# EAGLE design ALU (EAGLE 6.3)
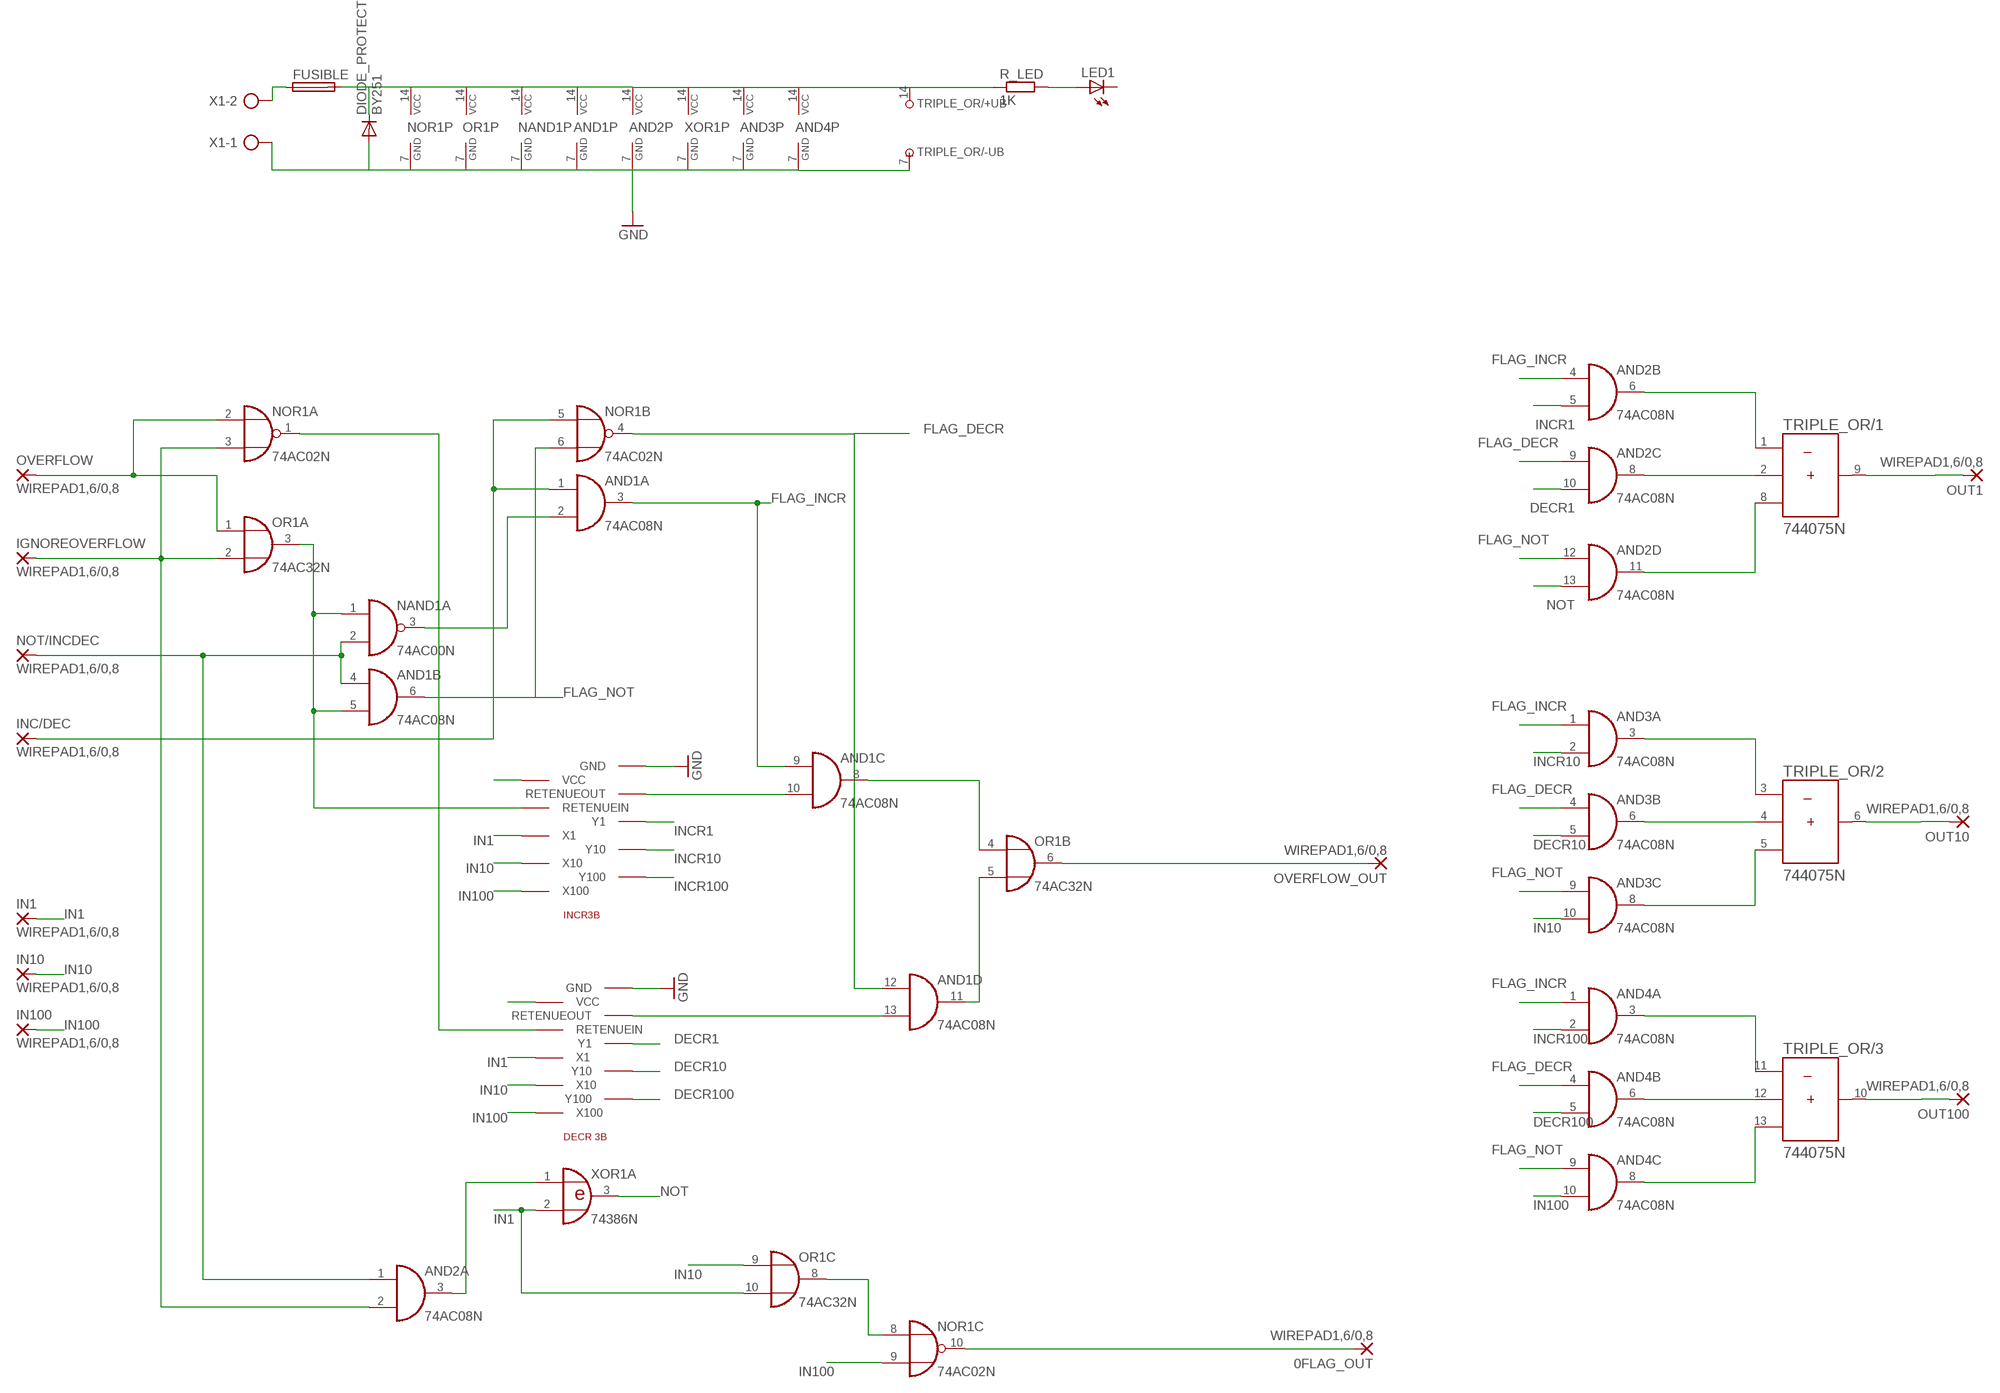
[diagram p0: schematic, sheet 1]

## Parts
0FLAG_OUT  WIREPAD1,6/0,8  [1,6/0,8]
AND1  74AC08N  [DIL14]
AND2  74AC08N  [DIL14]
AND3  74AC08N  [DIL14]
AND4  74AC08N  [DIL14]
DECR3B  DECR3B  [DECR3B]
DIODE_PROTECT  BY251  [DO201-15]
FUSIBLE  SH22,5A  [SH22,5A]
IGNOREOVERFLOW  WIREPAD1,6/0,8  [1,6/0,8]
IN1  WIREPAD1,6/0,8  [1,6/0,8]
IN10  WIREPAD1,6/0,8  [1,6/0,8]
IN100  WIREPAD1,6/0,8  [1,6/0,8]
INC/DEC  WIREPAD1,6/0,8  [1,6/0,8]
INCR3B  INCR3B  [INCR3B]
LED1  LEDSFH482  [SFH482]
NAND1  74AC00N  [DIL14]
NOR1  74AC02N  [DIL14]
NOT/INCDEC  WIREPAD1,6/0,8  [1,6/0,8]
OR1  74AC32N  [DIL14]
OUT1  WIREPAD1,6/0,8  [1,6/0,8]
OUT10  WIREPAD1,6/0,8  [1,6/0,8]
OUT100  WIREPAD1,6/0,8  [1,6/0,8]
OVERFLOW  WIREPAD1,6/0,8  [1,6/0,8]
OVERFLOW_OUT  WIREPAD1,6/0,8  [1,6/0,8]
R_LED  1K  R-EU_0207/10  [0207/10]
TRIPLE_OR  744075N  [DIL14]
X1  AK300/2  [AK300/2]
XOR1  74386N  [DIL14]

## Nets
0FLAG_OUT: 0FLAG_OUT.1(P) NOR1.10(C:O)
DECR1: AND2.10(C:I1) DECR3B.Y1
DECR10: AND3.5(B:I1) DECR3B.Y10
DECR100: AND4.5(B:I1) DECR3B.Y100
FLAG_DECR: AND1.12(D:I0) AND2.9(C:I0) AND3.4(B:I0) AND4.4(B:I0) NOR1.4(B:O)
FLAG_INCR: AND1.3(A:O) AND1.9(C:I0) AND2.4(B:I0) AND3.1(A:I0) AND4.1(A:I0)
FLAG_NOT: AND1.6(B:O) AND2.12(D:I0) AND3.9(C:I0) AND4.9(C:I0) NOR1.6(B:I1)
GND: AND1.7(P:GND) AND2.7(P:GND) AND3.7(P:GND) AND4.7(P:GND) DECR3B.GND DIODE_PROTECT.A INCR3B.GND NAND1.7(P:GND) NOR1.7(P:GND) OR1.7(P:GND) TRIPLE_OR.7(/-UB:-UB) X1.1 XOR1.7(P:GND)
IN1: DECR3B.X1 IN1.1(P) INCR3B.X1 OR1.10(C:I1) XOR1.2(A:I1)
IN10: AND3.10(C:I1) DECR3B.X10 IN10.1(P) INCR3B.X10 OR1.9(C:I0)
IN100: AND4.10(C:I1) DECR3B.X100 IN100.1(P) INCR3B.X100 NOR1.9(C:I1)
INCR1: AND2.5(B:I1) INCR3B.Y1
INCR10: AND3.2(A:I1) INCR3B.Y10
INCR100: AND4.2(A:I1) INCR3B.Y100
N$1: NOR1.2(A:I0) OR1.1(A:I0) OVERFLOW.1(P)
N$2: AND2.6(B:O) TRIPLE_OR.1(/1:A)
N$3: AND1.2(A:I1) NAND1.3(A:O)
N$4: AND1.1(A:I0) INC/DEC.1(P) NOR1.5(B:I0)
N$5: AND1.4(B:I0) AND2.1(A:I0) NAND1.2(A:I1) NOT/INCDEC.1(P)
N$6: AND1.5(B:I1) INCR3B.RETENUEIN NAND1.1(A:I0) OR1.3(A:O)
N$7: AND2.8(C:O) TRIPLE_OR.2(/1:B)
N$8: DECR3B.RETENUEIN NOR1.1(A:O)
N$9: AND1.8(C:O) OR1.4(B:I0)
N$10: AND1.13(D:I1) DECR3B.RETENUEOUT
N$11: AND1.10(C:I1) INCR3B.RETENUEOUT
N$12: AND1.11(D:O) OR1.5(B:I1)
N$13: OR1.6(B:O) OVERFLOW_OUT.1(P)
N$14: AND2.2(A:I1) IGNOREOVERFLOW.1(P) NOR1.3(A:I1) OR1.2(A:I1)
N$15: AND2.3(A:O) XOR1.1(A:I0)
N$16: NOR1.8(C:I0) OR1.8(C:O)
N$17: AND2.11(D:O) TRIPLE_OR.8(/1:C)
N$18: FUSIBLE.1 X1.2
N$19: LED1.A R_LED.2
N$24: AND3.3(A:O) TRIPLE_OR.3(/2:A)
N$25: AND3.6(B:O) TRIPLE_OR.4(/2:B)
N$26: AND3.8(C:O) TRIPLE_OR.5(/2:C)
N$27: AND4.3(A:O) TRIPLE_OR.11(/3:A)
N$28: AND4.6(B:O) TRIPLE_OR.12(/3:B)
N$29: AND4.8(C:O) TRIPLE_OR.13(/3:C)
NOT: AND2.13(D:I1) XOR1.3(A:O)
OUT1: OUT1.1(P) TRIPLE_OR.9(/1:Y)
OUT10: OUT10.1(P) TRIPLE_OR.6(/2:Y)
OUT100: OUT100.1(P) TRIPLE_OR.10(/3:Y)
VCC: AND1.14(P:VCC) AND2.14(P:VCC) AND3.14(P:VCC) AND4.14(P:VCC) DECR3B.VCC DIODE_PROTECT.C FUSIBLE.2 INCR3B.VCC NAND1.14(P:VCC) NOR1.14(P:VCC) OR1.14(P:VCC) R_LED.1 TRIPLE_OR.14(/+UB:+UB) XOR1.14(P:VCC)
Unconnected: AND3.11(D:O) AND3.12(D:I0) AND3.13(D:I1) AND4.11(D:O) AND4.12(D:I0) AND4.13(D:I1) LED1.K(C) NAND1.4(B:I0) NAND1.5(B:I1) NAND1.6(B:O) NAND1.8(C:O) NAND1.9(C:I0) NAND1.10(C:I1) NAND1.11(D:O) NAND1.12(D:I0) NAND1.13(D:I1) NOR1.11(D:I0) NOR1.12(D:I1) NOR1.13(D:O) OR1.11(D:O) OR1.12(D:I0) OR1.13(D:I1) XOR1.4(B:O) XOR1.5(B:I0) XOR1.6(B:I1) XOR1.8(C:I0) XOR1.9(C:I1) XOR1.10(C:O) XOR1.11(D:O) XOR1.12(D:I0) XOR1.13(D:I1)

## Library data of the parts
0FLAG_OUT IGNOREOVERFLOW IN1 IN10 IN100 INC/DEC NOT/INCDEC OUT1 OUT10 OUT100 OVERFLOW OVERFLOW_OUT = wirepad:WIREPAD: Wire PAD connect wire on PCB
AND1-AND4 = 74xx-eu:74*08: Quad 2-input AND gate
DECR3B = decrementeur3b:DECR3B
DIODE_PROTECT = diode:BY251: DIODE Si, 200 V, 3 A
FUSIBLE = fuse:SH22,5A: FUSE HOLDER grid 22,5mm, isolated cap OGN0031 8201, Schurter (Buerklin); MPN: 0031.7701.11; OC_FARNELL: unknown; OC_NEWARK: 04F1224
INCR3B = incrementeur3b:INCR3B
LED1 = led:LED: LED OSRAM: - CHIPLED LG R971, LG N971, LY N971, LG Q971, LY Q971, LO R971, LY R971 LH N974, LH R974 LS Q976, LO Q976, LY Q976 LO Q996 - Hyper CHIPLED LW Q18S LB Q993, LB Q99A, LB R99A - SideLED LS A670, LO A670, LY A670, LG A670, LP A670 LB A673, LV A673, LT A673, LW A673 LH A674 LY A675 LS A676, LA A676, LO A676, LY A676, LW A676 LS A679, LY A679, LG A679 - Hyper Micro SIDELED® LS Y876, LA Y876, LO Y876, LY Y876 LT Y87S - SmartLED LW L88C, LW L88S LB L89C, LB L89S, LG L890 LS L89K, LO L89K, LY L89K LS L896, LA L896, LO L896, LY L896 - TOPLED LS T670, LO T670, LY T670, LG T670, LP T670 LSG T670, LSP T670, LSY T670, LOP T670, LYG T670 LG T671, LOG T671, LSG T671 LB T673, LV T673, LT T673, LW T673 LH T674 LS T676, LA T676, LO T676, LY T676, LB T676, LH T676, LSB T676, LW T676 LB T67C, LV T67C, LT T67C, LS T67K, LO T67K, LY T67K, LW E67C LS E67B, LA E67B, LO E67B, LY E67B, LB E67C, LV E67C, LT E67C LW T67C LS T679, LY T679, LG T679 LS T770, LO T770, LY T770, LG T770, LP T770 LB T773, LV T773, LT T773, LW T773 LH T774 LS E675, LA E675, LY E675, LS T675 LS T776, LA T776, LO T776, LY T776, LB T776 LHGB T686 LT T68C, LB T68C - Hyper Mini TOPLED® LB M676 - Mini TOPLED Santana® LG M470 LS M47K, LO M47K, LY M47K Source: http://www.osram.convergy.de LUXEON: - LUMILED® LXK2-PW12-R00, LXK2-PW12-S00, LXK2-PW14-U00, LXK2-PW14-V00 LXK2-PM12-R00, LXK2-PM12-S00, LXK2-PM14-U00 LXK2-PE12-Q00, LXK2-PE12-R00, LXK2-PE12-S00, LXK2-PE14-T00, LXK2-PE14-U00 LXK2-PB12-K00, LXK2-PB12-L00, LXK2-PB12-M00, LXK2-PB14-N00, LXK2-PB14-P00, LXK2-PB14-Q00 LXK2-PR12-L00, LXK2-PR12-M00, LXK2-PR14-Q00, LXK2-PR14-R00 LXK2-PD12-Q00, LXK2-PD12-R00, LXK2-PD12-S00 LXK2-PH12-R00, LXK2-PH12-S00 LXK2-PL12-P00, LXK2-PL12-Q00, LXK2-PL12-R00 Source: www.luxeon.com KINGBRIGHT: KA-3528ASYC Source: www.kingbright.com
NAND1 = 74xx-eu:74*00: Quad 2-input NAND gate
NOR1 = 74xx-eu:74*02: Quad 2-input NOR gate
OR1 = 74xx-eu:74*32: Quad 2-input OR gate
R_LED = rcl:R-EU_: RESISTOR, European symbol
TRIPLE_OR = 74ttl-din:74*4075: Triple 3-input OR
X1 = con-ptr500:AK300/2: CONNECTOR; OC_FARNELL: unknown; OC_NEWARK: unknown
XOR1 = 74xx-eu:74*386: Quadruple 2-input EXCLUSIVE-OR (XOR) gate

## Net classes
0 default: width 0.61 mm, drill 0.599 mm, clearance 0.305 mm

## Board
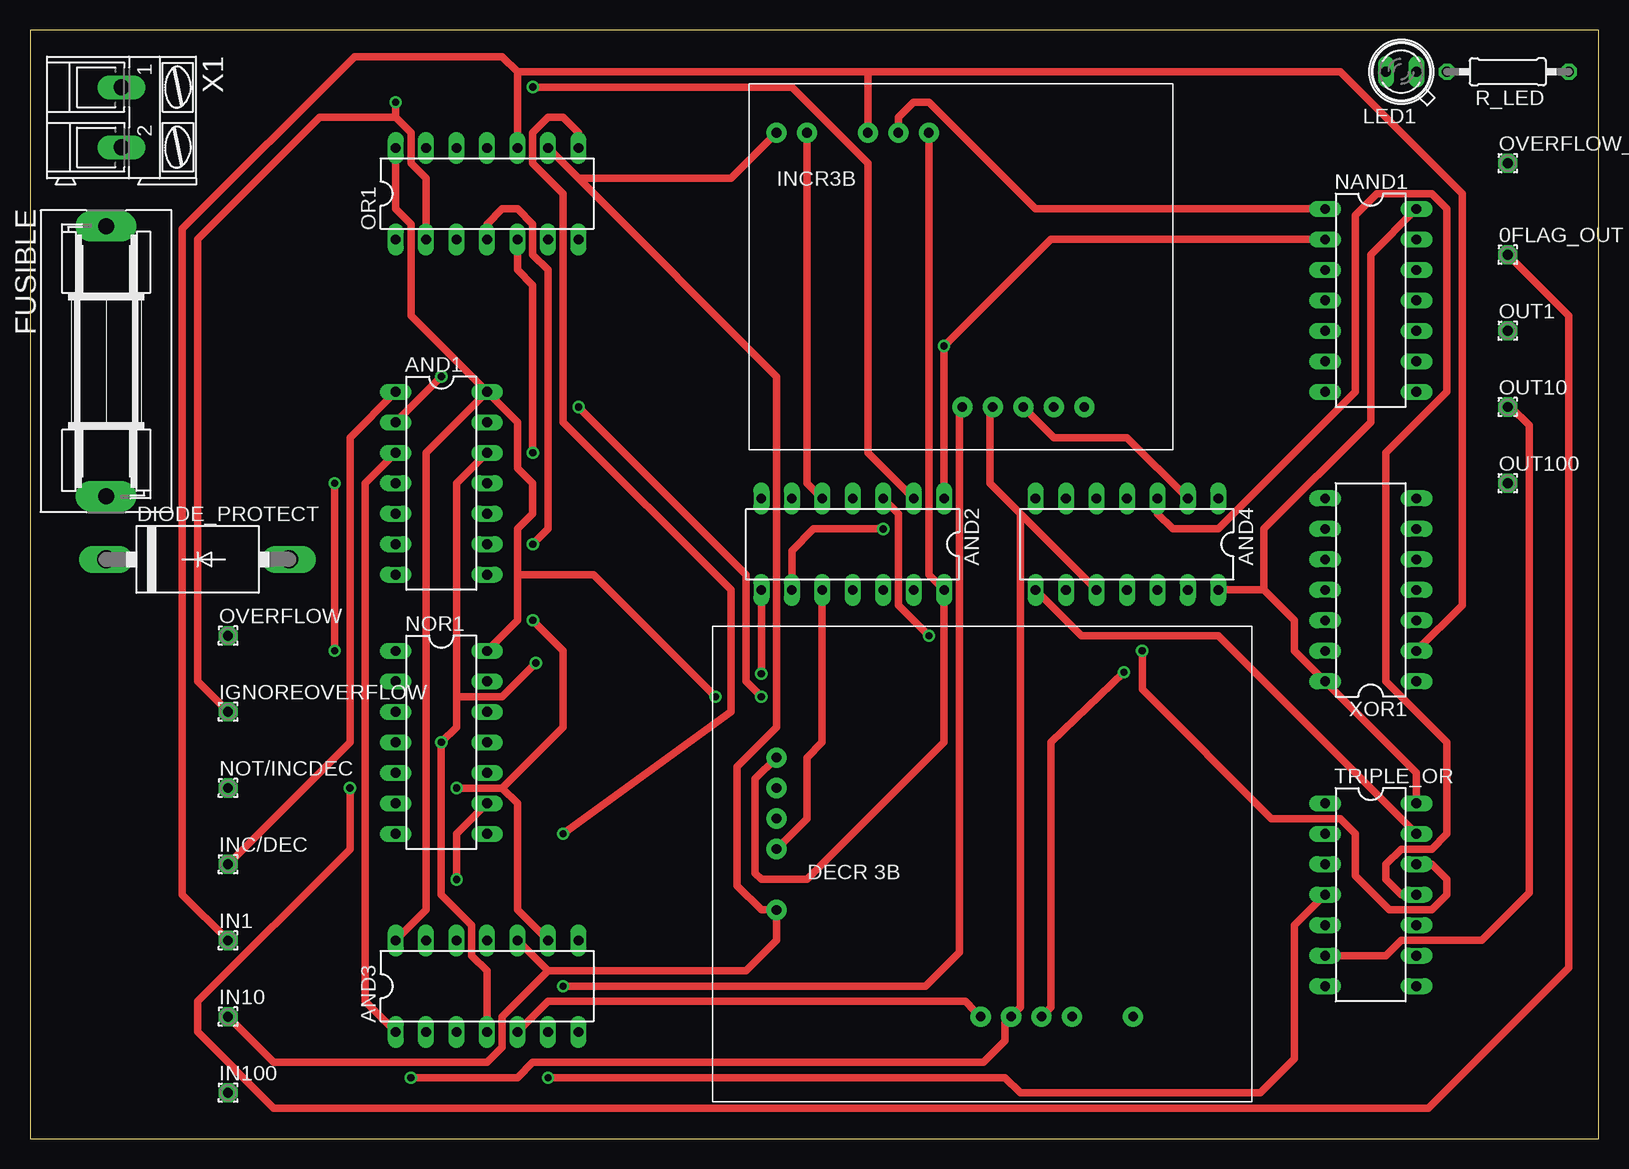
[diagram p1: board, top side]
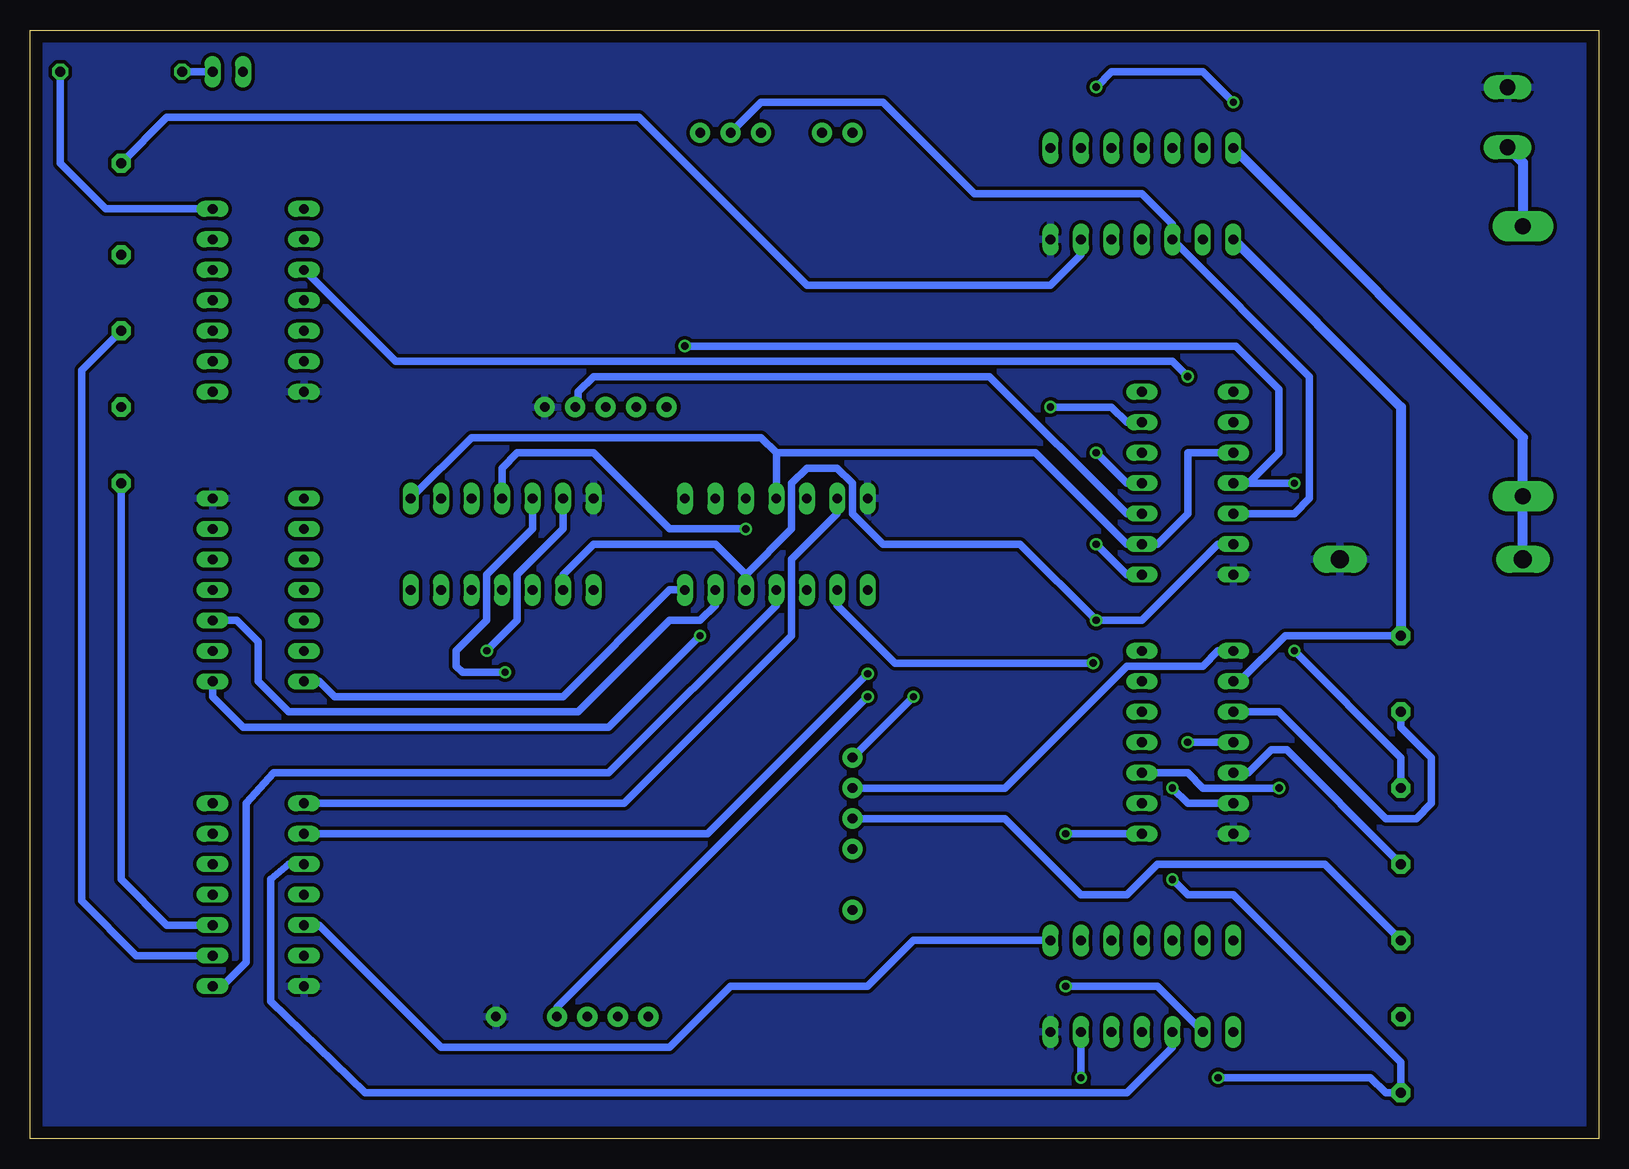
[diagram p2: board, bottom side, seen from below]

Size 130.79 x 92.38 mm. Coordinates in mm from the lower left corner, seen from the top.
Outline: 0,0 130.79,0 130.79,92.38 0,92.38 0,0
Copper layers (1*16): Top 0.035mm / dielectric 1.5mm / Bottom 0.035mm
Design rules "default *": minimum track width 10mil, minimum drill 20mil, track to track 12mil, track to pad 12mil, pad to pad 12mil, via to via 12mil, smd to smd 12mil, copper to edge 40mil, drill to drill 8mil, minimum pad ring 10mil, minimum via ring 8mil, stop-mask expansion 4mil, vias tented up to drill 0mil, thermal gap 10mil

### Footprints (pad centres in the part's own frame; a part is rotated, then mirrored left to right if it is on the bottom)
1,6/0,8 = drill 0.813 pad 1.6 octagon: 1 0,0
DIL14 = drill 0.813 long: 1 -7.62,-3.81; 2 -5.08,-3.81; 3 -2.54,-3.81; 4 0,-3.81; 5 2.54,-3.81; 6 5.08,-3.81; 7 7.62,-3.81; 8 7.62,3.81; 9 5.08,3.81; 10 2.54,3.81; 11 0,3.81; 12 -2.54,3.81; 13 -5.08,3.81; 14 -7.62,3.81
DECR3B = drill 0.8 pad 1.676: GND 29.718,-11.43; RETENUEIN 0,7.62; RETENUEOUT 24.638,-11.43; VCC 0,10.16; X1 0,5.08; X10 0,-2.54; X100 19.558,-11.43; Y1 0,2.54; Y10 17.018,-11.43; Y100 22.098,-11.43
DO201-15 = drill 1.499 long: A 7.62,0; C -7.62,0
SH22,5A = drill 1.321 pad 2.54 long: 1 -11.252,0; 2 11.252,0
INCR3B = drill 0.8 pad 1.676: GND 28.194,-20.32; RETENUEIN 12.7,2.54; RETENUEOUT 25.654,-20.32; VCC 15.24,2.54; X1 10.16,2.54; X10 2.54,2.54; X100 20.574,-20.32; Y1 5.08,2.54; Y10 18.034,-20.32; Y100 23.114,-20.32
SFH482 = drill 0.813 long: A -1.27,0; K 1.27,0
0207/10 = drill 0.813 octagon: 1 -5.08,0; 2 5.08,0
AK300/2 = drill 1.321 long: 1 -2.515,0; 2 2.489,0

### Placement (x,y rotation side)
0FLAG_OUT  123.19,73.66 0 top
AND1  34.29,54.61 270 top
AND2  68.58,49.53 180 top
AND3  38.1,12.7 0 top
AND4  91.44,49.53 180 top
DECR3B  62.23,21.59 0 top
DIODE_PROTECT  13.97,48.26 0 top
FUSIBLE  6.35,64.77 270 top
IGNOREOVERFLOW  16.51,35.56 0 top
IN1  16.51,16.51 0 top
IN10  16.51,10.16 0 top
IN100  16.51,3.81 0 top
INC/DEC  16.51,22.86 0 top
INCR3B  59.69,81.28 0 top
LED1  114.3,88.9 180 top
NAND1  111.76,69.85 270 top
NOR1  34.29,33.02 270 top
NOT/INCDEC  16.51,29.21 0 top
OR1  38.1,78.74 0 top
OUT1  123.19,67.31 0 top
OUT10  123.19,60.96 0 top
OUT100  123.19,54.61 0 top
OVERFLOW  16.51,41.91 0 top
OVERFLOW_OUT  123.19,81.28 0 top
R_LED  123.19,88.9 180 top
TRIPLE_OR  111.76,20.32 270 top
X1  7.62,85.09 270 top
XOR1  111.76,45.72 90 top

### Tracks (layer width: path | path; a pad name or v marks a point on that pad's centre or on a via)
0FLAG_OUT  (via drill 0.6 pad 1.02)
  Top 0.61: 0FLAG_OUT.1 128.27,68.58 128.27,14.25 116.56,2.54 20.32,2.54 13.97,8.89 13.97,11.43 26.67,24.13 v26.67,29.21
  Bottom 0.61: NOR1.10 34.29,30.48 33.02,29.21 v26.67,29.21
DECR1
  Top 0.61: AND2.10 66.04,33.02 64.77,31.75 64.77,26.67 DECR3B.Y1
DECR10
  Top 0.61: AND3.5 43.18,11.43 77.98,11.43 78.74,10.67 DECR3B.Y10
DECR100  (via drill 0.6 pad 1.02)
  Top 0.61: v91.19,38.86 85.09,33.02 85.09,10.92 DECR3B.Y100
  Bottom 0.61: v91.19,38.86 94.74,38.86 95.25,39.37 95.25,40.64 92.71,43.18 92.71,46.99 88.9,50.8 AND4.5
FLAG_DECR  (via drill 0.6 pad 1.02)
  Top 0.61: 35.56,36.83 35.56,54.61 AND1.12 | 35.56,36.83 35.56,34.29 v34.29,33.02 34.29,20.32 36.83,17.78 36.83,15.24 38.1,13.97 AND3.4 | v42.16,39.62 39.37,36.83 35.56,36.83 | AND2.9 63.5,49 65.3,50.8 v71.12,50.8
  Bottom 0.61: v34.29,33.02 NOR1.4 | AND2.9 63.5,44.45 58.67,39.62 v42.16,39.62 | AND4.4 91.44,55.88 90.17,57.15 83.82,57.15 77.47,50.8 v71.12,50.8
FLAG_INCR
  Top 0.61: AND3.1 27.94,11.43 27.94,54.61 AND1.3
  Bottom 0.61: 68.58,57.15 69.85,58.42 93.98,58.42 AND4.1 | 68.58,57.15 AND2.4 | AND1.3 34.29,57.15 34.29,52.07 36.83,49.53 AND1.9 39.37,49.53 46.99,57.15 68.58,57.15
FLAG_NOT  (via drill 0.6 pad 1.02)
  Top 0.61: AND3.9 40.64,19.05 40.64,27.94 39.37,29.21 | v35.56,29.21 39.37,29.21 | v41.91,43.18 44.45,40.64 44.45,34.29 39.37,29.21
  Bottom 0.61: 71.12,46.99 AND2.12 | 71.12,46.99 73.66,49.53 83.82,49.53 86.36,46.99 AND4.9 | v35.56,29.21 34.29,27.94 NOR1.6 | AND1.6 31.75,49.53 38.1,43.18 v41.91,43.18 48.26,49.53 59.69,49.53 62.23,52.07 62.23,54.61 63.5,55.88 66.04,55.88 67.31,54.61 67.31,50.8 71.12,46.99
GND
  pour Bottom: -2.54,93.98 134.62,93.98 134.62,-3.81 -2.54,-1.27
IN1
  Top 0.61: 40.64,88.9 OR1.10 | 69.85,88.9 40.64,88.9 | INCR3B.X1 69.85,88.9 | XOR1.2 119.38,44.45 119.38,78.74 109.22,88.9 69.85,88.9 | IN1.1 12.7,20.32 12.7,75.8 27.07,90.17 39.37,90.17 40.64,88.9
  Bottom 0.61: DECR3B.X1 49.53,26.67 43.18,20.32 39.37,20.32 36.83,22.86 22.86,22.86 IN1.1
IN10
  Top 0.61: 45.72,80.01 OR1.9 | INCR3B.X10 58.42,80.01 45.72,80.01 | 43.18,13.97 AND3.10 | 43.18,13.97 59.69,13.97 62.23,16.51 DECR3B.X10 60.96,19.05 58.93,21.08 58.93,30.99 62.23,34.29 62.23,63.5 45.72,80.01 | 43.18,13.97 39.37,10.16 39.37,7.62 38.1,6.35 20.32,6.35 IN10.1
IN100  (via drill 0.6 pad 1.02)
  Top 0.61: NOR1.9 35.56,25.4 v35.56,21.59 | 82.55,52.07 80.01,54.61 80.01,60.96 INCR3B.X100 | 82.55,52.07 AND4.10 | 82.55,52.07 82.55,10.92 DECR3B.X100 81.28,9.65 81.28,8.15 79.48,6.35 41.91,6.35 40.64,5.08 v31.75,5.08
  Bottom 0.61: v35.56,21.59 34.29,20.32 30.48,20.32 16.51,6.35 IN100.1 17.78,3.81 19.05,5.08 v31.75,5.08
INCR1
  Top 0.61: AND2.5 64.77,54.61 INCR3B.Y1
INCR10  (via drill 0.6 pad 1.02)
  Top 0.61: v44.45,12.7 74.63,12.7 77.47,15.54 77.47,60.96 INCR3B.Y10
  Bottom 0.61: v44.45,12.7 36.83,12.7 AND3.2
INCR100
  Top 0.61: AND4.2 91.44,58.42 85.34,58.42 INCR3B.Y100
N$1
  Bottom 0.61: NOR1.2 29.97,38.1 26.16,41.91 OVERFLOW.1
  Bottom 0.813: OR1.1 16.51,60.96 OVERFLOW.1
N$2
  Bottom 0.61: AND2.6 63.5,52.07 67.31,48.26 67.31,41.91 81.28,27.94 TRIPLE_OR.1
N$3  (via drill 0.6 pad 1.02)
  Top 0.61: v34.29,63.5 AND1.2
  Bottom 0.61: v34.29,63.5 35.56,64.77 100.33,64.77 NAND1.3
N$4
  Top 0.61: AND1.1 26.67,58.42 26.67,33.02 INC/DEC.1
  Bottom 0.61: NOR1.5 29.21,30.48 27.3,32.39 26.03,32.39 17.15,23.49 INC/DEC.1
N$5  (via drill 0.6 pad 1.02)
  Top 0.61: AND2.1 v76.2,66.04 85.09,74.93 NAND1.2 | v25.4,54.61 v25.4,40.64
  Bottom 0.61: 29.21,54.61 26.67,57.15 26.67,62.45 30.26,66.04 v76.2,66.04 | 29.21,54.61 AND1.4 | 29.21,54.61 v25.4,54.61 | v25.4,40.64 16.51,31.75 NOT/INCDEC.1
N$6
  Top 0.61: NAND1.1 83.82,77.47 77.47,83.82 74.93,86.36 73.66,86.36 72.39,85.09 INCR3B.RETENUEIN
  Bottom 0.61: INCR3B.RETENUEIN 69.85,86.36 59.69,86.36 52.07,78.74 38.1,78.74 35.56,76.2 OR1.3 24.13,63.5 24.13,53.34 25.4,52.07 AND1.5
N$7  (via drill 0.6 pad 1.02)
  Top 0.61: v60.96,38.73 AND2.8
  Bottom 0.61: v60.96,38.73 74.3,25.4 TRIPLE_OR.2
N$8
  Bottom 0.61: NOR1.1 31.75,40.64 33.02,39.37 39.37,39.37 49.53,29.21 DECR3B.RETENUEIN
N$9  (via drill 0.6 pad 1.02)
  Top 0.61: v41.91,49.53 43.18,50.8 43.18,72.39 41.91,73.66 41.91,76.2 40.64,77.47 39.37,77.47 38.1,76.2 OR1.4
  Bottom 0.61: AND1.8 39.37,46.99 v41.91,49.53
N$10  (via drill 0.6 pad 1.02)
  Top 0.61: v45.72,60.96 59.69,46.99 59.69,38.1 v60.96,36.83
  Bottom 0.61: AND1.13 39.37,59.69 40.64,60.96 v45.72,60.96 | DECR3B.RETENUEOUT 86.87,10.92 v60.96,36.83
N$11
  Bottom 0.61: INCR3B.RETENUEOUT 85.09,60.96 85.09,62.23 83.82,63.5 50.8,63.5 39.37,52.07 AND1.10
N$12  (via drill 0.6 pad 1.02)
  Top 0.61: v41.91,57.15 41.91,71.12 40.64,72.39 OR1.5
  Bottom 0.61: AND1.11 39.37,54.61 v41.91,57.15
N$13
  Bottom 0.61: OR1.6 43.18,73.66 45.72,71.12 66.04,71.12 80.01,85.09 119.38,85.09 OVERFLOW_OUT.1
N$14  (via drill 0.6 pad 1.02)
  Top 0.61: OR1.2 33.02,80.01 31.75,81.28 31.75,83.82 30.48,85.09 | IGNOREOVERFLOW.1 13.97,38.1 13.97,74.93 24.13,85.09 30.48,85.09 | AND2.2 69.85,57.15 69.85,81.28 63.5,87.63 v41.91,87.63 | v30.48,86.36 30.48,85.09
  Bottom 0.61: NOR1.3 26.67,35.56 24.13,33.02 17.78,26.67 15.24,26.67 13.97,27.94 13.97,31.75 16.51,34.29 IGNOREOVERFLOW.1 | v41.91,87.63 40.64,88.9 33.02,88.9 v30.48,86.36
N$15  (via drill 0.6 pad 1.02)
  Top 0.61: AND2.3 72.39,52.07 72.39,44.45 v74.93,41.91
  Bottom 0.61: v74.93,41.91 82.55,34.29 113.03,34.29 115.57,36.83 XOR1.1
N$16  (via drill 0.6 pad 1.02)
  Top 0.61: v44.45,25.4 58.42,35.56 58.42,45.72 44.45,59.69 44.45,78.74 41.91,81.28 41.91,83.82 43.18,85.09 44.45,85.09 45.72,83.82 OR1.8
  Bottom 0.61: v44.45,25.4 NOR1.8
N$17
  Bottom 0.61: TRIPLE_OR.8 114.76,12.7 112.78,14.68 112.78,27.94 110.49,30.48 85.09,30.48 83.82,30.48 82.55,30.48 68.58,44.45 AND2.11
N$18
  Bottom 0.813: X1.2 6.35,81.33 FUSIBLE.1
N$19
  Bottom 0.61: R_LED.2 LED1.A
N$24
  Bottom 0.61: AND3.3 35.56,7.62 39.37,3.81 102.87,3.81 110.74,11.43 110.74,21.59 109.22,22.86 TRIPLE_OR.3
N$25  (via drill 0.6 pad 1.02)
  Top 0.61: v43.18,5.08 81.28,5.08 82.55,3.81 102.57,3.81 105.41,6.65 105.41,17.78 TRIPLE_OR.4
  Bottom 0.61: v43.18,5.08 AND3.6
N$26
  Bottom 0.61: TRIPLE_OR.5 106.68,17.78 96.52,7.62 77.47,7.62 72.39,12.7 60.96,12.7 57.15,16.51 AND3.8
N$27
  Top 0.61: AND4.3 93.98,52.07 95.25,50.8 99.06,50.8 110.49,62.23 110.49,76.94 112.29,78.74 116.84,78.74 118.11,77.47 118.11,62.23 113.03,57.15 113.03,38.1 118.11,33.02 118.11,25.4 116.84,24.13 114.3,24.13 113.03,22.86 113.03,21.59 114.3,20.32 TRIPLE_OR.11
N$28  (via drill 0.6 pad 1.02)
  Top 0.61: v92.71,40.64 92.71,37.45 103.49,26.67 109.22,26.67 110.49,25.4 110.49,21.89 113.33,19.05 116.84,19.05 118.11,20.32 118.11,21.59 116.84,22.86 TRIPLE_OR.12
  Bottom 0.61: v92.71,40.64 90.17,43.18 90.17,46.99 86.36,50.8 AND4.6
N$29
  Top 0.61: AND4.8 87.63,41.91 99.06,41.91 104.14,36.83 TRIPLE_OR.13
NOT
  Bottom 0.61: AND2.13 73.66,44.45 74.93,43.18 77.47,43.18 85.09,35.56 109.22,35.56 111.76,38.1 111.76,41.38 113.56,43.18 XOR1.3
OUT1
  Bottom 0.61: TRIPLE_OR.9 121.92,15.24 126.49,19.81 126.49,64.01 OUT1.1
OUT10
  Top 0.61: TRIPLE_OR.6 113.03,15.24 114.3,16.51 121,16.51 124.97,20.48 124.97,59.44 123.44,60.96 OUT10.1
OUT100
  Bottom 0.61: TRIPLE_OR.10 119.38,17.78 123.19,21.59 OUT100.1
VCC  (via drill 0.6 pad 1.02)
  Top 0.61: AND3.14 33.02,19.05 33.02,57.15 AND1.14 | NOR1.14 40.64,43.18 40.64,46.99 | 40.64,46.99 40.64,50.8 41.91,52.07 41.91,54.61 40.64,55.88 40.64,59.69 AND1.14 | AND1.14 31.75,68.58 31.75,76.2 30.48,77.47 OR1.14 | 102.87,45.72 105.41,43.18 105.41,40.64 XOR1.14 115.57,30.48 TRIPLE_OR.14 | AND4.14 102.87,45.72 | NAND1.14 111.76,73.66 111.76,59.69 102.87,50.8 102.87,45.72 | INCR3B.VCC 74.93,46.99 AND2.14 76.2,33.02 64.77,21.59 60.96,21.59 60.45,22.1 60.45,29.97 DECR3B.VCC | v57.15,36.83 46.99,46.99 40.64,46.99
  Bottom 0.61: XOR1.14 106.68,38.1 105.41,36.83 86.36,36.83 77.47,45.72 AND2.14 | DECR3B.VCC v57.15,36.83 | NAND1.14 124.46,77.47 128.27,81.28 R_LED.1
  Bottom 0.813: OR1.14 6.35,58.42 FUSIBLE.2 DIODE_PROTECT.C